# EAGLE design SD_Handler (EAGLE 7.7.0)
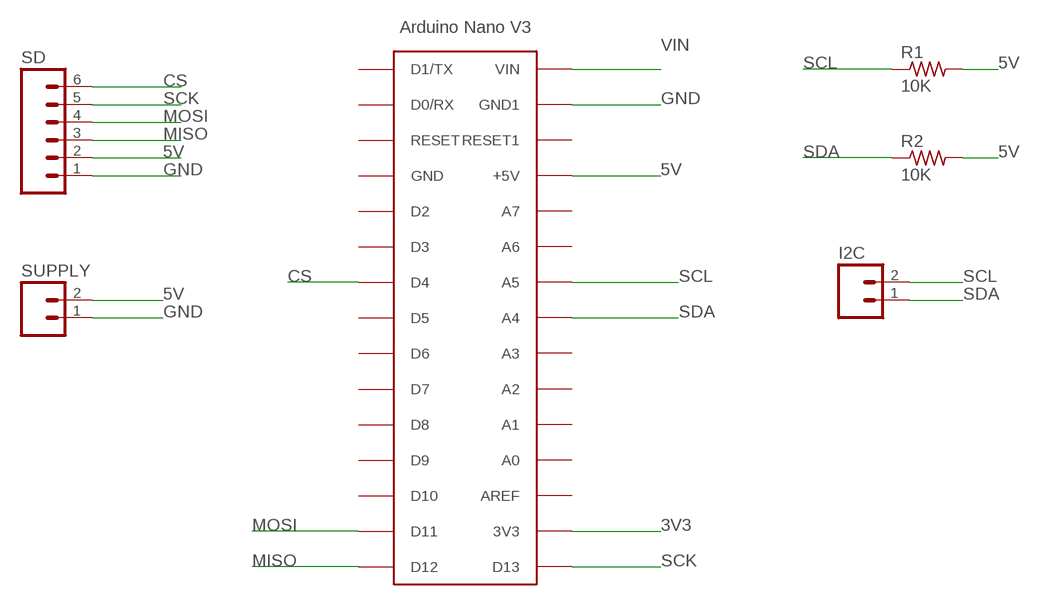
[diagram p0: schematic, sheet 1]

## Parts
I2C  M02  [02P]
R1  10K  R-US_0207/10  [0207/10]
R2  10K  R-US_0207/10  [0207/10]
SD  M06LONGPADS  [1X06_LONGPADS]
SUPPLY  M02  [02P]
U$1  ARDUINONANO  [PDIP-32]

## Nets
3V3: U$1.3V3
5V: R1.2 R2.2 SD.2 SUPPLY.2 U$1.+5V
CS: SD.6 U$1.D4
GND: SD.1 SUPPLY.1 U$1.GND1
MISO: SD.3 U$1.D12
MOSI: SD.4 U$1.D11
SCK: SD.5 U$1.D13
SCL: I2C.2 R1.1 U$1.A2(A5)
SDA: I2C.1 R2.1 U$1.A3(A4)
VIN: U$1.VIN
Unconnected: U$1.A0(A7) U$1.A1(A6) U$1.A4(A3) U$1.A5(A2) U$1.A6(A1) U$1.A7(A0) U$1.AREF U$1.D0/RX U$1.D1/TX U$1.D2 U$1.D3 U$1.D5 U$1.D6 U$1.D7 U$1.D8 U$1.D9 U$1.D10 U$1.GND U$1.RESET U$1.RESET1

## Library data of the parts
I2C SUPPLY = con-amp-quick:M02: AMP QUICK CONNECTOR; OC_FARNELL: unknown; OC_NEWARK: unknown
R1 R2 = resistor:R-US_: RESISTOR, American symbol
SD = SparkFun:M06: Header 6 Standard 6-pin 0.1" header. Use with straight break away headers (SKU : PRT-00116), right angle break away headers (PRT-00553), swiss pins (PRT-00743), machine pins (PRT-00117), and female headers (PRT-00115). Molex polarized connector foot print use with SKU : PRT-08094 with associated crimp pins and housings. NOTES ON THE VARIANTS LOCK and LOCK_LONGPADS... This footprint was designed to help hold the alignment of a through-hole component (i.e. 6-pin header) while soldering it into place. You may notice that each hole has been shifted either up or down by 0.005 of an inch from it's more standard position (which is a perfectly straight line). This slight alteration caused the pins (the squares in the middle) to touch the edges of the holes. Because they are alternating, it causes a "brace" to hold the component in place. 0.005 has proven to be the perfect amount of "off-center" position when using our standard breakaway headers. Although looks a little odd when you look at the bare footprint, once you have a header in there, the alteration is very hard to notice. Also,if you push a header all the way into place, it is covered up entirely on the bottom side. This idea of altering the position of holes to aid alignment will be further integrated into the Sparkfun Library for other footprints. It can help hold any component with 3 or more connection pins.
U$1 = CRE-Lib1:ARDUINONANO: Arduino Nano

## Net classes
0 default: width 0.559 mm

## Board
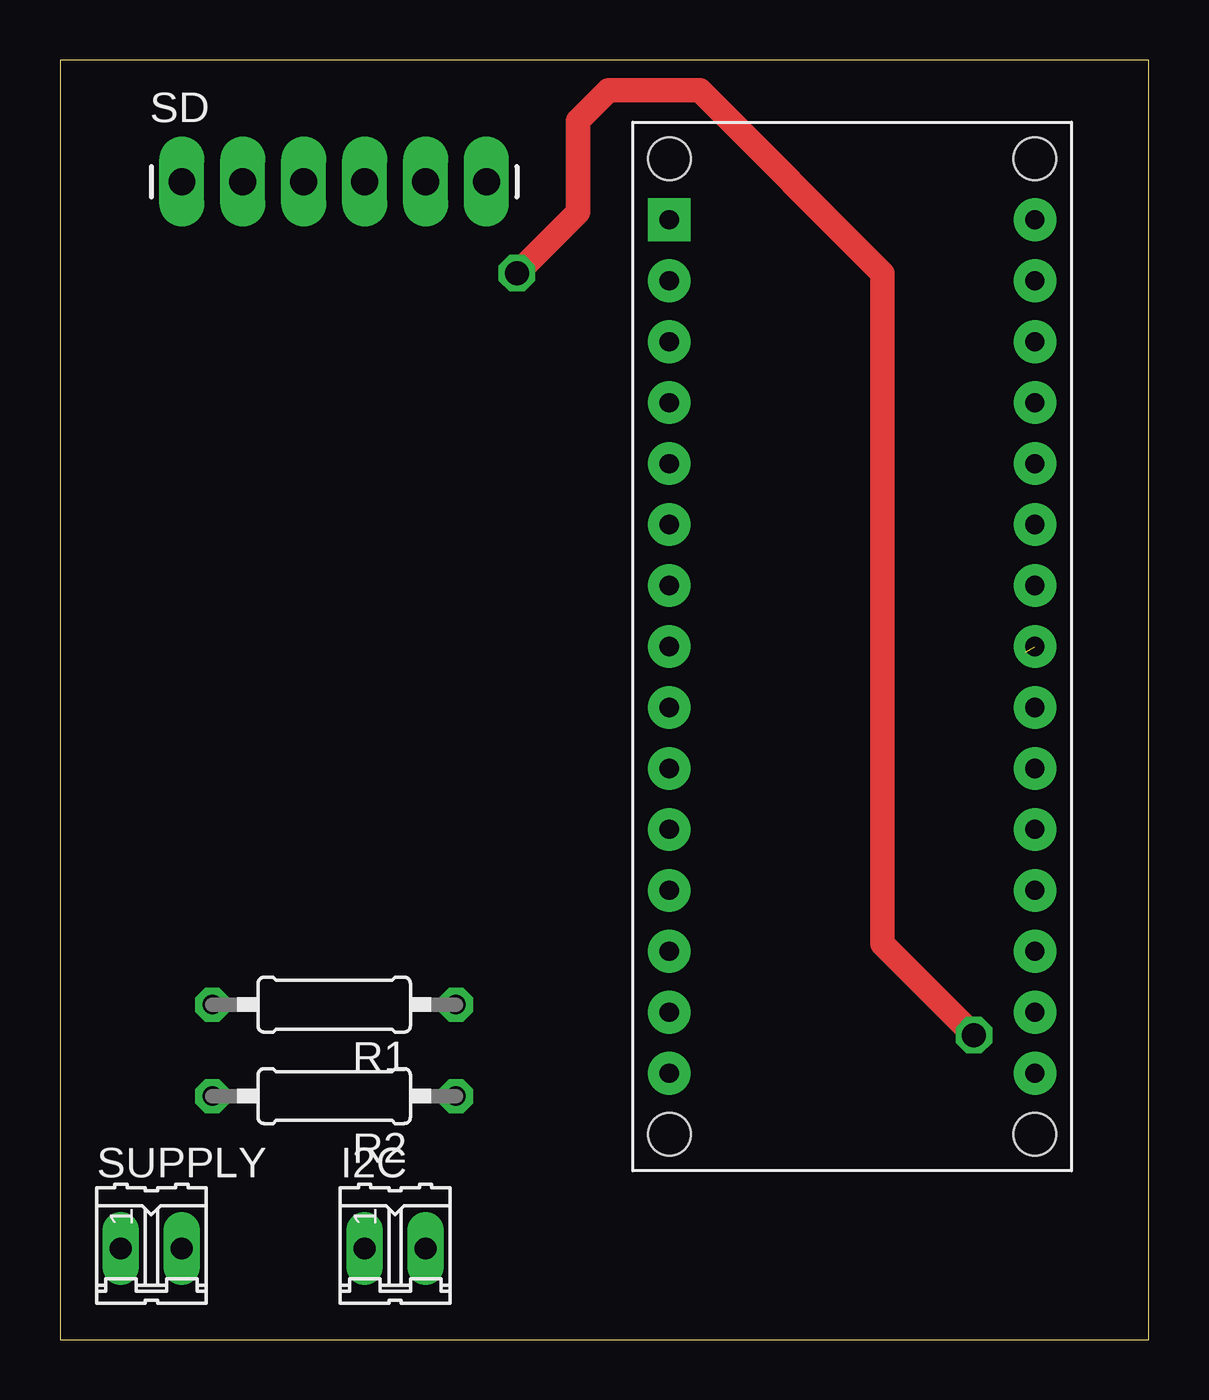
[diagram p1: board, top side]
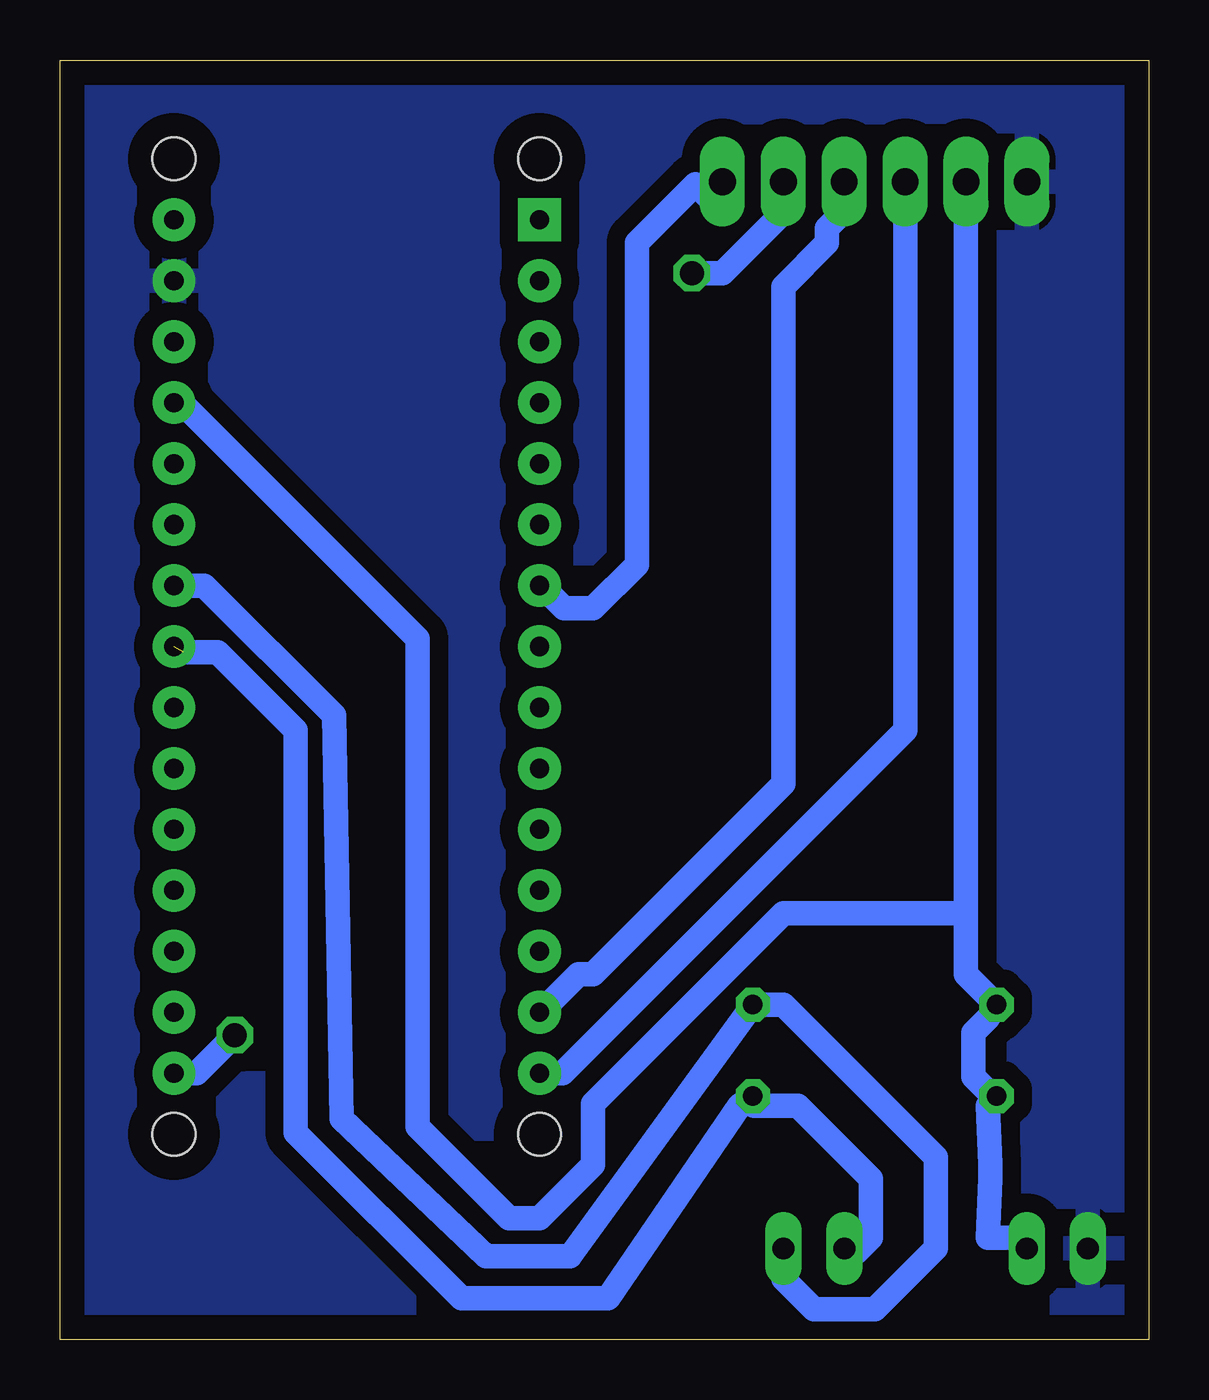
[diagram p2: board, bottom side, seen from below]

Size 45.39 x 53.33 mm. Coordinates in mm from the lower left corner, seen from the top.
Outline: 0,0 45.39,0 45.39,53.33 0,53.33 0,0
Copper layers (1*16): Top 0.035mm / dielectric 1.5mm / Bottom 0.035mm
Design rules "default *": minimum track width 10mil, minimum drill 24mil, track to track 8mil, track to pad 8mil, pad to pad 8mil, via to via 8mil, smd to smd 8mil, copper to edge 40mil, drill to drill 8mil, minimum pad ring 12mil, minimum via ring 8mil, stop-mask expansion 4mil, vias tented up to drill 0mil, thermal gap 10mil

### Footprints (pad centres in the part's own frame; a part is rotated, then mirrored left to right if it is on the bottom)
02P = drill 0.914 long: 1 -1.27,0; 2 1.27,0
0207/10 = drill 0.813 octagon: 1 -5.08,0; 2 5.08,0
1X06_LONGPADS = drill 1.118 pad 1.88 long: 1 0,0; 2 2.54,0; 3 5.08,0; 4 7.62,0; 5 10.16,0; 6 12.7,0
PDIP-32 = drill 0.8 pad 1.778: 3V3 15.24,-35.56; +5V 15.24,-10.16; A0 15.24,-12.7; A1 15.24,-15.24; A2 15.24,-17.78; A3 15.24,-20.32; A4 15.24,-22.86; A5 15.24,-25.4; A6 15.24,-27.94; A7 15.24,-30.48; AREF 15.24,-33.02; D0/RX 0,-5.08; D2 0,-12.7; D3 0,-15.24; D4 0,-17.78; D5 0,-20.32; D6 0,-22.86; D7 0,-25.4; D8 0,-27.94; D9 0,-30.48; D10 0,-33.02; D11 0,-35.56; D12 0,-38.1; D13 15.24,-38.1; GND 0,-10.16; GND1 15.24,-5.08; RESET 0,-7.62; RESET1 15.24,-7.62; VIN 15.24,-2.54 | drill 0.8 pad 1.778 square: D1/TX 0,-2.54 | hole 1.778: 0,0; 0,-40.64; 15.24,-40.64; 15.24,0

### Placement (x,y rotation side)
I2C  13.97,3.81 0 top
R1  11.43,13.97 180 top
R2  11.43,10.16 180 top
SD  5.08,48.26 0 top
SUPPLY  3.81,3.81 0 top
U$1  25.4,49.21 0 top

### Tracks (layer width: path | path; a pad name or v marks a point on that pad's centre or on a via)
5V
  Bottom 1.016: SUPPLY.2 5.49,4.27 6.71,4.27 6.6,6.71 6.6,7.32 6.71,9.75 R2.2 6.71,10.36 7.32,10.97 7.32,12.8 6.71,13.41 R1.2 7.62,15.24 7.62,17.78 | SD.2 7.62,17.78 | U$1.+5V 40.32,39.05 30.48,29.21 30.48,8.89 26.67,5.08 25.4,5.08 23.18,7.3 23.18,9.84 15.24,17.78 7.62,17.78
CS
  Bottom 1.016: U$1.D4 24.99,31.09 24.38,30.48 23.16,30.48 21.34,32.31 21.34,45.72 18.9,48.16 18.29,47.55 17.68,47.55 17.68,48.16 SD.6
GND
  pour Bottom (isolate 0.762): 0,53.34 0,0 45.09,0 45.09,53.34
MISO
  Bottom 1.016: U$1.D12 24.45,11.11 10.16,25.4 SD.3
MOSI
  Bottom 1.016: U$1.D11 24.99,14.02 23.77,15.24 23.16,15.24 15.24,23.16 15.24,43.89 13.41,45.72 13.41,46.33 12.8,46.94 12.8,48.16 SD.4
SCK  (via drill 1 pad 1.52)
  Top 1.016: v19.05,44.45 21.59,46.99 21.59,50.8 22.86,52.07 26.67,52.07 34.29,44.45 34.29,16.51 v38.1,12.7
  Bottom 1.016: SD.5 15.24,46.99 17.78,44.45 v19.05,44.45 | v38.1,12.7 39.69,11.11 U$1.D13
SCL
  Bottom 1.016: 15.24,3.66 I2C.2 15.24,2.54 13.97,1.27 11.43,1.27 8.89,3.81 8.89,7.62 15.24,13.97 R1.1 24.13,3.49 27.62,3.49 33.66,9.21 33.97,26.04 39.37,31.43 U$1.A2
SDA  (1 unrouted)
  Bottom 1.016: I2C.1 12.19,3.66 11.58,4.27 11.58,6.71 14.63,9.75 16.46,9.75 R2.1 17.07,9.75 22.55,1.73 28.65,1.73 35.56,8.64 35.56,25.4 38.81,28.65 40.23,28.65